# Altium schematic sheet IMU_Sensor.SchDoc
size A4; SheetNumber: 3; SheetTotal: 4
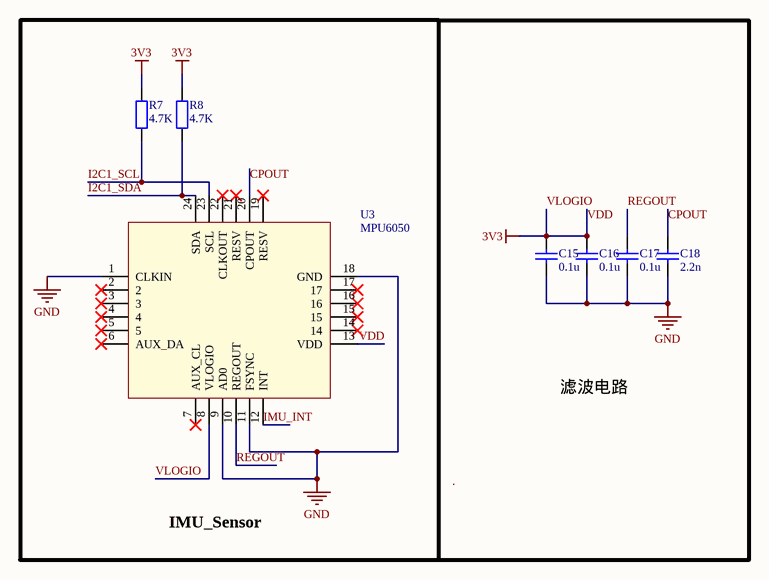
[diagram p0: IMU_Sensor.SchDoc]

## Parts
C15  0.1u  [C0402_M]
C16  0.1u  [C0402_M]
C17  0.1u  [C0402_M]
C18  2.2n  [C0402_M]
R7  4.7K  [R0402_M]
R8  4.7K  [R0402_M]
U3  MPU6050  [QFN-24_L4.0-W4.0-P0.50-BL-EP2.7]

## Nets
GND: C15.1 C16.1 C17.1 C18.1 U3.1(CLKIN) U3.9(AD0) U3.11(FSYNC) U3.18(GND)
VDD: C15.2 C16.2 R7.2 R8.2 U3.8(VLOGIO) U3.13(VDD)  [also labelled 3V3, VLOGIO]
CPOUT: C18.2 U3.20(CPOUT)
I2C1_SCL: R7.1 U3.23(SCL)
I2C1_SDA: R8.1 U3.24(SDA)
IMU_INT: U3.12(INT)
REGOUT: C17.2 U3.10(REGOUT)

Not connected (* = marked no-connect by the designer): U3 2* 3* 4* 5* 6(AUX_DA)* 7(AUX_CL)* 14* 15* 16* 17* 19(RESV)* 21(RESV)* 22(CLKOUT)*

## Notes on the sheet
- 滤波电路
- IMU_Sensor
- Labels drawn without touching a wire or pin: ·

## Library data of the parts
C15-C18 = C: 贴片电容/MLCC电容; BOM名称: 无极性贴片电容; 当前库版本V2022.12.25 @淘宝卖家:黄晶宝石: 最新版本发布https://shop463601444.taobao.com
R7 R8 = R: 贴片电阻; 联系下单店铺卖家 免费帮你查找封装: 联系下单店铺卖家 免费技术支持; BOM名称: 贴片电阻
U3 = MPU6050: 三轴加速度+三轴陀螺仪; 封装库来自淘宝卖家：黄晶宝石: 其他店铺购入均为盗版封装库，请立即申请退款，本店现金奖励100~500元; BOM名称: MPU6050